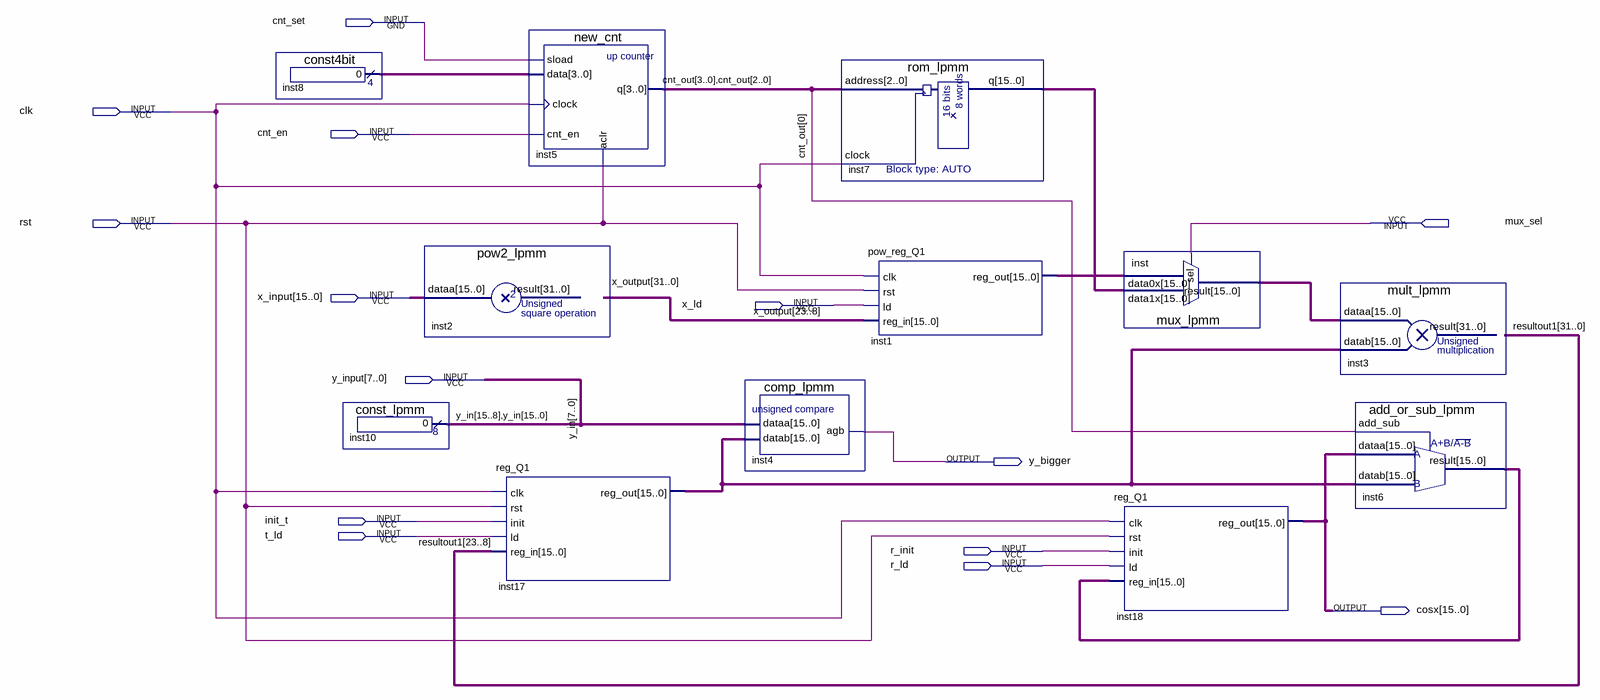
[diagram p0: schematic sheet]
// Quartus schematic cos_Q1.bdf as structural Verilog: 12 symbols, 14 pins
module cos_Q1 (
  input  cnt_set,
  input  clk,
  input  cnt_en,
  input  rst,
  input  mux_sel,
  input  [15:0] x_input,
  input  x_ld,
  input  [7:0] y_input,
  input  init_t,
  input  t_ld,
  input  r_init,
  input  r_ld,
  output y_bigger,
  output [15:0] cosx
);

  wire [3:0] cnt_out, inst8_result;
  wire [15:0] inst1_reg_out, inst6_result, inst7_q, inst17_reg_out, inst_result;
  wire [15:8] y_in;
  wire [31:0] resultout1, x_output;

  const4bit inst8 (.result(inst8_result));
  const_lpmm inst10 (.result({y_in, y_in, y_input}));
  pow2_lpmm inst2 (.dataa(x_input), .result(x_output));
  reg_Q1 inst17 (.clk(clk), .rst(rst), .init(init_t), .ld(t_ld), .reg_in(resultout1[23:8]), .reg_out(inst17_reg_out));
  new_cnt inst5 (
    .sload(cnt_set), .data(inst8_result), .clock(clk), .cnt_en(cnt_en), .aclr(rst),
    .q({cnt_out, cnt_out[2:0]}));
  comp_lpmm inst4 (.dataa({y_in, y_in, y_input}), .datab(inst17_reg_out), .agb(y_bigger));
  rom_lpmm inst7 (.address({cnt_out, cnt_out[2:0]}), .clock(clk), .q(inst7_q));
  pow_reg_Q1 inst1 (.clk(clk), .rst(rst), .ld(x_ld), .reg_in(x_output[23:8]), .reg_out(inst1_reg_out));
  reg_Q1 inst18 (.clk(clk), .rst(rst), .init(r_init), .ld(r_ld), .reg_in(inst6_result), .reg_out(cosx));
  mux_lpmm inst (.data1x(inst7_q), .data0x(inst1_reg_out), .sel(mux_sel), .result(inst_result));
  mult_lpmm inst3 (.dataa(inst_result), .datab(inst17_reg_out), .result(resultout1));
  add_or_sub_lpmm inst6 (.add_sub(cnt_out[0]), .dataa(cosx), .datab(inst17_reg_out), .result(inst6_result));

  // Other names for the same wires on the sheet: y_in[7:0] = y_input
endmodule
